# Altium schematic sheet 11) TEST POINTS.SchDoc
size 447 x 332 mm
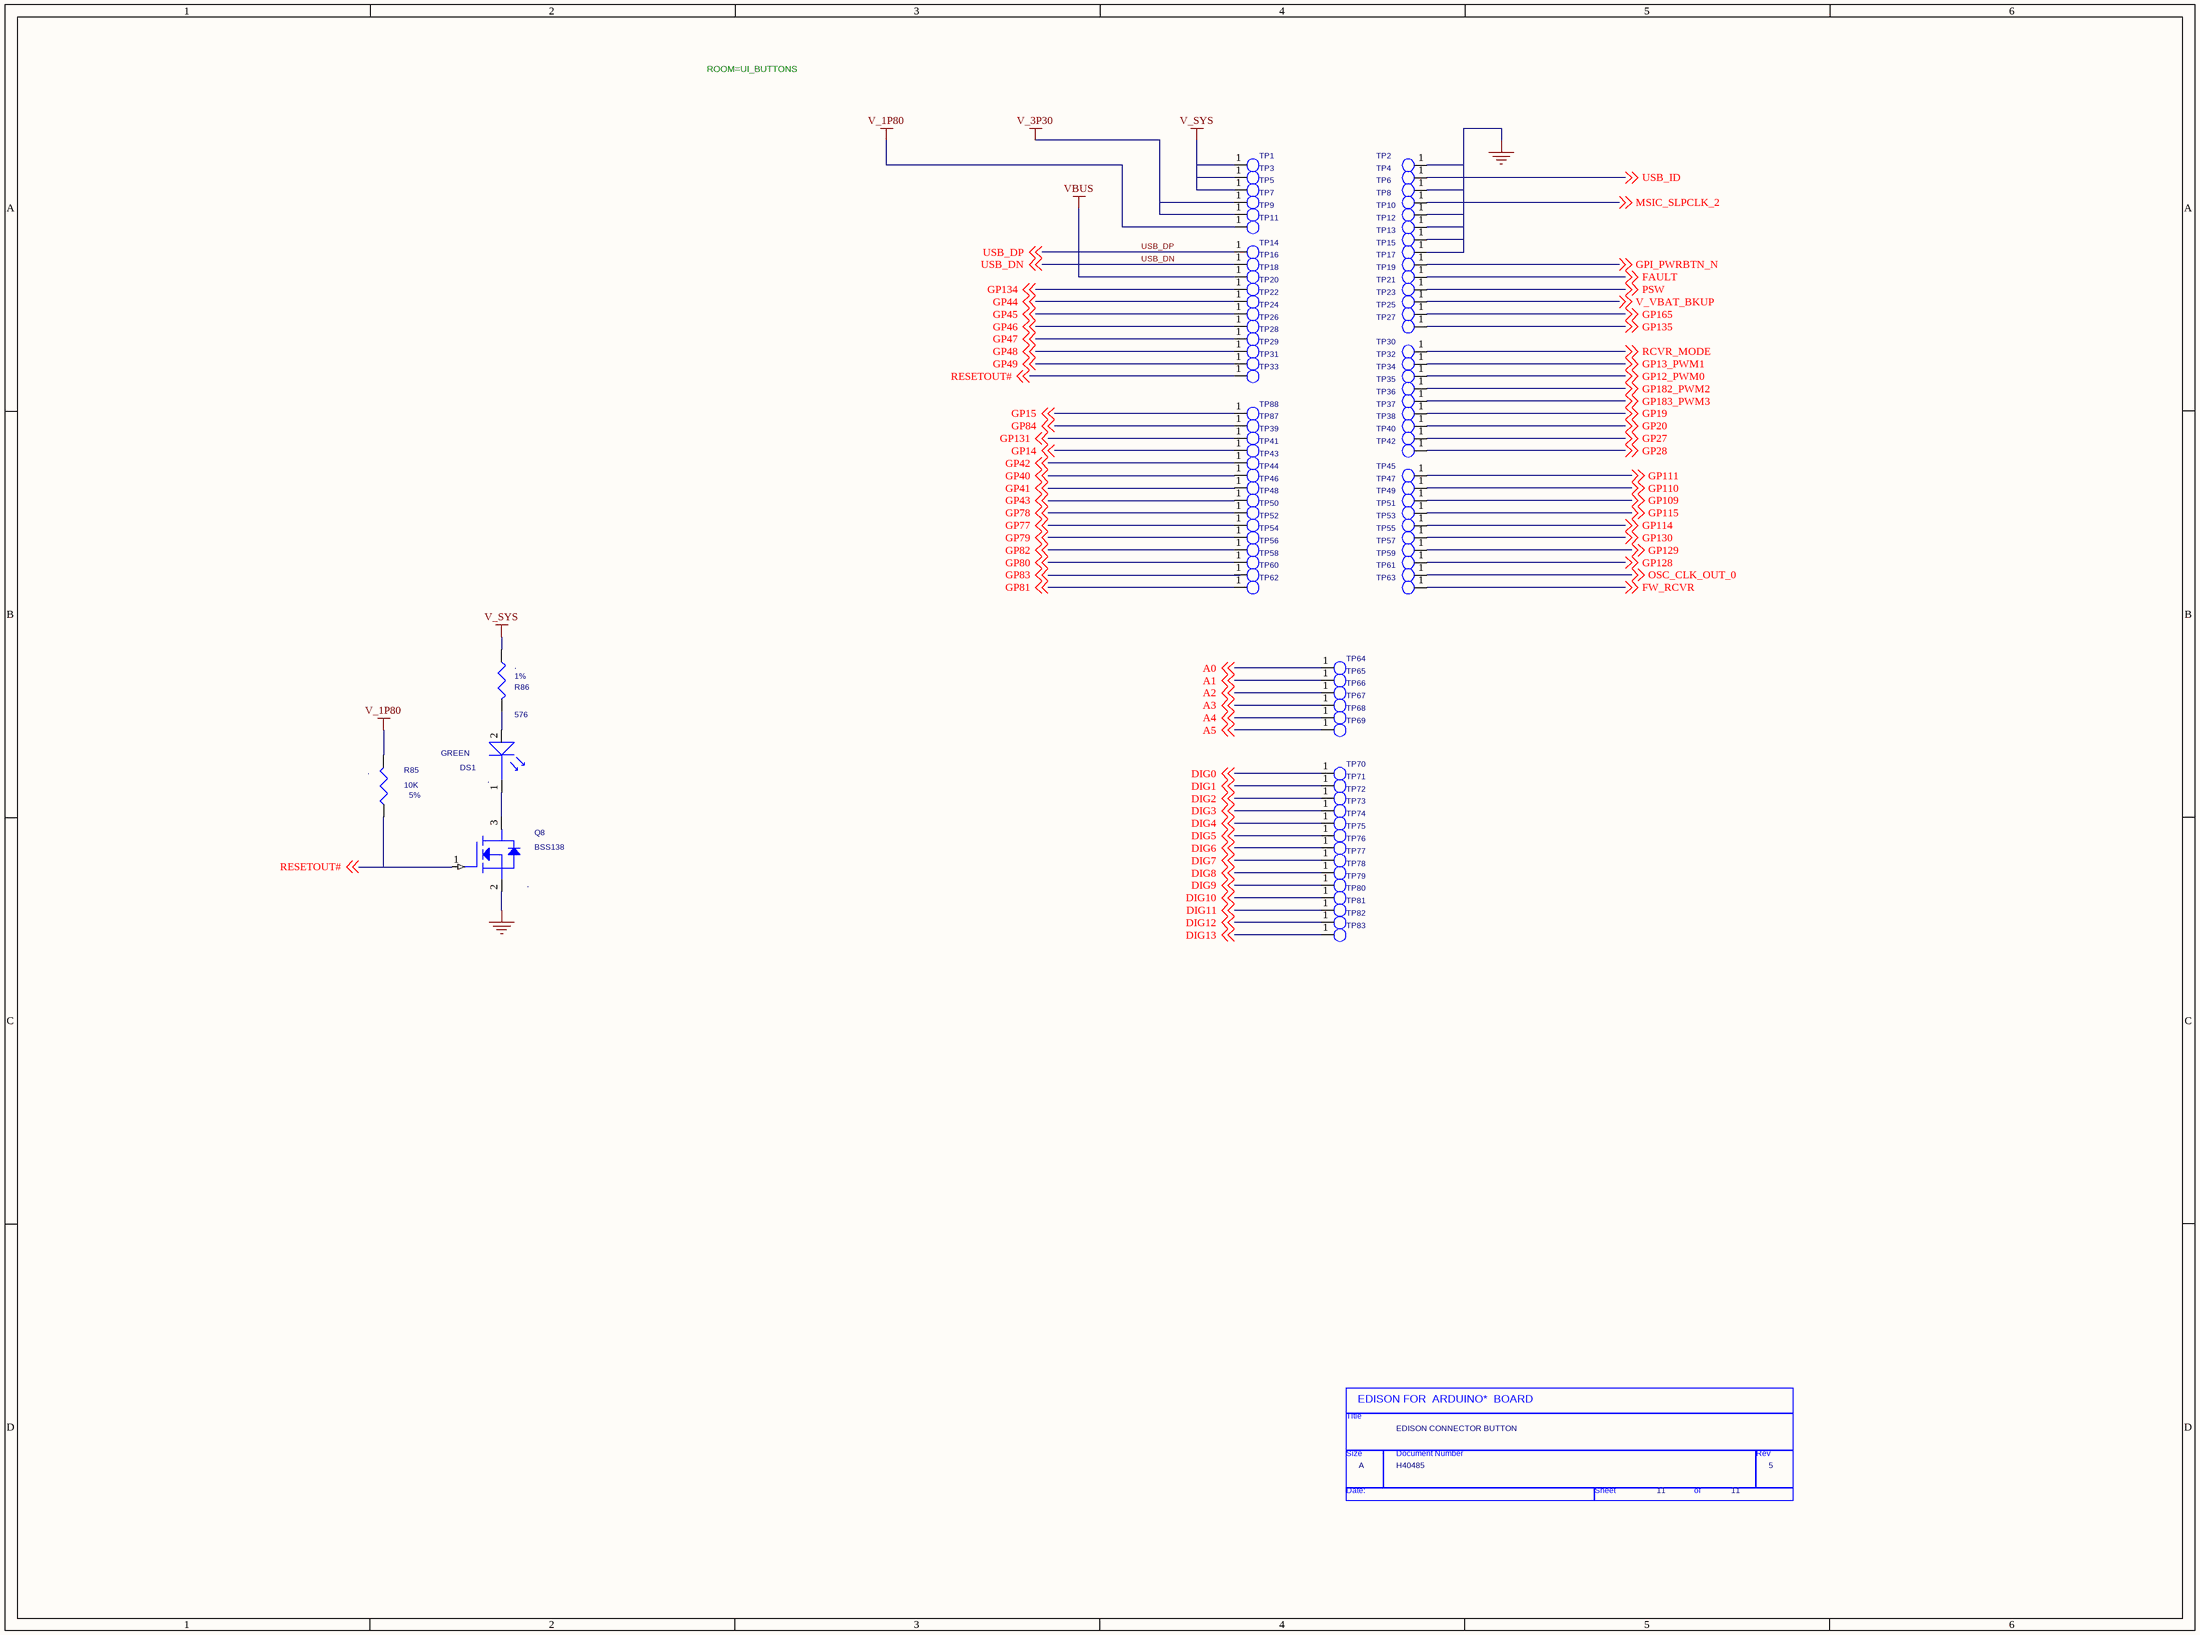
[diagram p0: 11) TEST POINTS.SchDoc]

## Parts
*  Page Count: 11  Page Size: A  Title: EDISON CONNECTOR BUTTON  RevCode: 5  Doc: H40485  (hidden comment: TitleBlock0)  (graphical)
DS1  GREEN  NO_STUFF: .  [smled0402]
Q8  BSS138  NO_STUFF: .  [SOT23]
R85  10K  NO_STUFF: .  TOL: 5%  [SMR0201]
R86  576  NO_STUFF: .  TOL: 1%  [SMR0201]
TP1  30 MIL TESTPAD  [TESTPAD_C80]  (value not drawn)
TP2  30 MIL TESTPAD  [TESTPAD_C80]  (value not drawn)
TP3  30 MIL TESTPAD  [TESTPAD_C80]  (value not drawn)
TP4  30 MIL TESTPAD  [TESTPAD_C80]  (value not drawn)
TP5  30 MIL TESTPAD  [TESTPAD_C80]  (value not drawn)
TP6  30 MIL TESTPAD  [TESTPAD_C80]  (value not drawn)
TP7  30 MIL TESTPAD  [TESTPAD_C80]  (value not drawn)
TP8  30 MIL TESTPAD  [TESTPAD_C80]  (value not drawn)
TP9  30 MIL TESTPAD  [TESTPAD_C80]  (value not drawn)
TP10  30 MIL TESTPAD  [TESTPAD_C80]  (value not drawn)
TP11  30 MIL TESTPAD  [TESTPAD_C80]  (value not drawn)
TP12  30 MIL TESTPAD  [TESTPAD_C80]  (value not drawn)
TP13  30 MIL TESTPAD  [TESTPAD_C80]  (value not drawn)
TP14  30 MIL TESTPAD  [TESTPAD_C80]  (value not drawn)
TP15  30 MIL TESTPAD  [TESTPAD_C80]  (value not drawn)
TP16  30 MIL TESTPAD  [TESTPAD_C80]  (value not drawn)
TP17  30 MIL TESTPAD  [TESTPAD_C80]  (value not drawn)
TP18  30 MIL TESTPAD  [TESTPAD_C80]  (value not drawn)
TP19  30 MIL TESTPAD  [TESTPAD_C80]  (value not drawn)
TP20  30 MIL TESTPAD  [TESTPAD_C80]  (value not drawn)
TP21  30 MIL TESTPAD  [TESTPAD_C80]  (value not drawn)
TP22  30 MIL TESTPAD  [TESTPAD_C80]  (value not drawn)
TP23  30 MIL TESTPAD  [TESTPAD_C80]  (value not drawn)
TP24  30 MIL TESTPAD  [TESTPAD_C80]  (value not drawn)
TP25  30 MIL TESTPAD  [TESTPAD_C80]  (value not drawn)
TP26  30 MIL TESTPAD  [TESTPAD_C80]  (value not drawn)
TP27  30 MIL TESTPAD  [TESTPAD_C80]  (value not drawn)
TP28  30 MIL TESTPAD  [TESTPAD_C80]  (value not drawn)
TP29  30 MIL TESTPAD  [TESTPAD_C80]  (value not drawn)
TP30  30 MIL TESTPAD  [TESTPAD_C80]  (value not drawn)
TP31  30 MIL TESTPAD  [TESTPAD_C80]  (value not drawn)
TP32  30 MIL TESTPAD  [TESTPAD_C80]  (value not drawn)
TP33  30 MIL TESTPAD  [TESTPAD_C80]  (value not drawn)
TP34  30 MIL TESTPAD  [TESTPAD_C80]  (value not drawn)
TP35  30 MIL TESTPAD  [TESTPAD_C80]  (value not drawn)
TP36  30 MIL TESTPAD  [TESTPAD_C80]  (value not drawn)
TP37  30 MIL TESTPAD  [TESTPAD_C80]  (value not drawn)
TP38  30 MIL TESTPAD  [TESTPAD_C80]  (value not drawn)
TP39  30 MIL TESTPAD  [TESTPAD_C80]  (value not drawn)
TP40  30 MIL TESTPAD  [TESTPAD_C80]  (value not drawn)
TP41  30 MIL TESTPAD  [TESTPAD_C80]  (value not drawn)
TP42  30 MIL TESTPAD  [TESTPAD_C80]  (value not drawn)
TP43  30 MIL TESTPAD  [TESTPAD_C80]  (value not drawn)
TP44  30 MIL TESTPAD  [TESTPAD_C80]  (value not drawn)
TP45  30 MIL TESTPAD  [TESTPAD_C80]  (value not drawn)
TP46  30 MIL TESTPAD  [TESTPAD_C80]  (value not drawn)
TP47  30 MIL TESTPAD  [TESTPAD_C80]  (value not drawn)
TP48  30 MIL TESTPAD  [TESTPAD_C80]  (value not drawn)
TP49  30 MIL TESTPAD  [TESTPAD_C80]  (value not drawn)
TP50  30 MIL TESTPAD  [TESTPAD_C80]  (value not drawn)
TP51  30 MIL TESTPAD  [TESTPAD_C80]  (value not drawn)
TP52  30 MIL TESTPAD  [TESTPAD_C80]  (value not drawn)
TP53  30 MIL TESTPAD  [TESTPAD_C80]  (value not drawn)
TP54  30 MIL TESTPAD  [TESTPAD_C80]  (value not drawn)
TP55  30 MIL TESTPAD  [TESTPAD_C80]  (value not drawn)
TP56  30 MIL TESTPAD  [TESTPAD_C80]  (value not drawn)
TP57  30 MIL TESTPAD  [TESTPAD_C80]  (value not drawn)
TP58  30 MIL TESTPAD  [TESTPAD_C80]  (value not drawn)
TP59  30 MIL TESTPAD  [TESTPAD_C80]  (value not drawn)
TP60  30 MIL TESTPAD  [TESTPAD_C80]  (value not drawn)
TP61  30 MIL TESTPAD  [TESTPAD_C80]  (value not drawn)
TP62  30 MIL TESTPAD  [TESTPAD_C80]  (value not drawn)
TP63  30 MIL TESTPAD  [TESTPAD_C80]  (value not drawn)
TP64  30 MIL TESTPAD  [TESTPAD_C80]  (value not drawn)
TP65  30 MIL TESTPAD  [TESTPAD_C80]  (value not drawn)
TP66  30 MIL TESTPAD  [TESTPAD_C80]  (value not drawn)
TP67  30 MIL TESTPAD  [TESTPAD_C80]  (value not drawn)
TP68  30 MIL TESTPAD  [TESTPAD_C80]  (value not drawn)
TP69  30 MIL TESTPAD  [TESTPAD_C80]  (value not drawn)
TP70  30 MIL TESTPAD  [TESTPAD_C80]  (value not drawn)
TP71  30 MIL TESTPAD  [TESTPAD_C80]  (value not drawn)
TP72  30 MIL TESTPAD  [TESTPAD_C80]  (value not drawn)
TP73  30 MIL TESTPAD  [TESTPAD_C80]  (value not drawn)
TP74  30 MIL TESTPAD  [TESTPAD_C80]  (value not drawn)
TP75  30 MIL TESTPAD  [TESTPAD_C80]  (value not drawn)
TP76  30 MIL TESTPAD  [TESTPAD_C80]  (value not drawn)
TP77  30 MIL TESTPAD  [TESTPAD_C80]  (value not drawn)
TP78  30 MIL TESTPAD  [TESTPAD_C80]  (value not drawn)
TP79  30 MIL TESTPAD  [TESTPAD_C80]  (value not drawn)
TP80  30 MIL TESTPAD  [TESTPAD_C80]  (value not drawn)
TP81  30 MIL TESTPAD  [TESTPAD_C80]  (value not drawn)
TP82  30 MIL TESTPAD  [TESTPAD_C80]  (value not drawn)
TP83  30 MIL TESTPAD  [TESTPAD_C80]  (value not drawn)
TP87  30 MIL TESTPAD  [TESTPAD_C80]  (value not drawn)
TP88  30 MIL TESTPAD  [TESTPAD_C80]  (value not drawn)

## Nets
GND: Q8.2(S) TP2.1 TP6.1 TP10.1 TP12.1 TP13.1 TP15.1
V_1P80: R85.2 TP11.1
V_3P30: TP7.1 TP9.1
V_SYS: R86.2 TP1.1 TP3.1 TP5.1
VBUS: TP18.1
A0: TP64.1 ; off-sheet A0
A1: TP65.1 ; off-sheet A1
A2: TP66.1 ; off-sheet A2
A3: TP67.1 ; off-sheet A3
A4: TP68.1 ; off-sheet A4
A5: TP69.1 ; off-sheet A5
DIG0: TP70.1 ; off-sheet DIG0
DIG1: TP71.1 ; off-sheet DIG1
DIG2: TP72.1 ; off-sheet DIG2
DIG3: TP73.1 ; off-sheet DIG3
DIG4: TP74.1 ; off-sheet DIG4
DIG5: TP75.1 ; off-sheet DIG5
DIG6: TP76.1 ; off-sheet DIG6
DIG7: TP77.1 ; off-sheet DIG7
DIG8: TP78.1 ; off-sheet DIG8
DIG9: TP79.1 ; off-sheet DIG9
DIG10: TP80.1 ; off-sheet DIG10
DIG11: TP81.1 ; off-sheet DIG11
DIG12: TP82.1 ; off-sheet DIG12
DIG13: TP83.1 ; off-sheet DIG13
FAULT: TP19.1 ; off-sheet FAULT
FW_RCVR: TP63.1 ; off-sheet FW_RCVR
GP12_PWM0: TP34.1 ; off-sheet GP12_PWM0
GP13_PWM1: TP32.1 ; off-sheet GP13_PWM1
GP14: TP41.1 ; off-sheet GP14
GP15: TP88.1 ; off-sheet GP15
GP19: TP37.1 ; off-sheet GP19
GP20: TP38.1 ; off-sheet GP20
GP27: TP40.1 ; off-sheet GP27
GP28: TP42.1 ; off-sheet GP28
GP40: TP44.1 ; off-sheet GP40
GP41: TP46.1 ; off-sheet GP41
GP42: TP43.1 ; off-sheet GP42
GP43: TP48.1 ; off-sheet GP43
GP44: TP22.1 ; off-sheet GP44
GP45: TP24.1 ; off-sheet GP45
GP46: TP26.1 ; off-sheet GP46
GP47: TP28.1 ; off-sheet GP47
GP48: TP29.1 ; off-sheet GP48
GP49: TP31.1 ; off-sheet GP49
GP77: TP52.1 ; off-sheet GP77
GP78: TP50.1 ; off-sheet GP78
GP79: TP54.1 ; off-sheet GP79
GP80: TP58.1 ; off-sheet GP80
GP81: TP62.1 ; off-sheet GP81
GP82: TP56.1 ; off-sheet GP82
GP83: TP60.1 ; off-sheet GP83
GP84: TP87.1 ; off-sheet GP84
GP109: TP49.1 ; off-sheet GP109
GP110: TP47.1 ; off-sheet GP110
GP111: TP45.1 ; off-sheet GP111
GP114: TP53.1 ; off-sheet GP114
GP115: TP51.1 ; off-sheet GP115
GP128: TP59.1 ; off-sheet GP128
GP129: TP57.1 ; off-sheet GP129
GP130: TP55.1 ; off-sheet GP130
GP131: TP39.1 ; off-sheet GP131
GP134: TP20.1 ; off-sheet GP134
GP135: TP27.1 ; off-sheet GP135
GP165: TP25.1 ; off-sheet GP165
GP182_PWM2: TP35.1 ; off-sheet GP182_PWM2
GP183_PWM3: TP36.1 ; off-sheet GP183_PWM3
GPI_PWRBTN_N: TP17.1 ; off-sheet GPI_PWRBTN_N
MSIC_SLPCLK_2: TP8.1 ; off-sheet MSIC_SLPCLK_2
OSC_CLK_OUT_0: TP61.1 ; off-sheet OSC_CLK_OUT_0
PSW: TP21.1 ; off-sheet PSW
RCVR_MODE: TP30.1 ; off-sheet RCVR_MODE
RESETOUT#: Q8.1(G) R85.1 TP33.1 ; off-sheet RESETOUT#
USB_DN: TP16.1 ; off-sheet USB_DN
USB_DP: TP14.1 ; off-sheet USB_DP
USB_ID: TP4.1 ; off-sheet USB_ID
V_VBAT_BKUP: TP23.1 ; off-sheet V_VBAT_BKUP
NetDS1_1: DS1.1(LED1) Q8.3(D)
NetDS1_2: DS1.2(LED2) R86.1

## Notes on the sheet
- ROOM=UI_BUTTONS
- (in symbol TitleBlock0) EDISON FOR  ARDUINO*  BOARD; Title; Size; Document Number; Rev; Date:; Sheet; of

## Library data of the parts
DS1 = LED,SMT,GREEN,V,0402: LED,1005,SM,GRN,V,1.00,RC,1; Device: E54986-003; LEAD_FREE: YES; BOM: x; IPN: E54986-003; PART_NUMBER: E54986-003; FINANCE: x
Q8 = XSTR,BSS138,FET,NCH,SOT23: IC,DS,FET N,SOT-23,BSS138LT3G; FINANCE: x; LEAD_FREE: YES; Device: C81974-001; BOM: x; IPN: C81974-001; PART_NUMBER: C81974-001
R85 = RESD,0201,5%,1/20W,10K: RES D,0201,10.00 kOHM,5.00%,1/20W,YES; Device: C80792-002; BOM: x; ROOM: AUDIO_CODEC; RATING: 1/20W; IPN: C80792-002; PART_NUMBER: C80792-002; LEAD_FREE: YES; FINANCE: x
R86 = RESD,0201,1%,1/20W,562: RES D,0402,576.00 OHM,1.00%,1/16W,YES; PART_NUMBER: A93548-403; RATING: 1/20W; BOM: x; LEAD_FREE: YES; FINANCE: x
TP1-TP83 TP87 TP88 = TestPad,C80,SMT: LEAD_FREE: NO; FINANCE: x; IPN: TESTPAD_80; DEVICE: TESTPAD_30; ROOM: TEST_APE; BOM: x; PART_NUMBER: TESTPAD_30; NO_STUFF: NO_STUFF
* = TitleBlock0: Page Number: 11; Page Create Date: March  8, 1995